# Altium schematic sheet 2015-03-26_02-24-551.schdoc
size 186 x 111 mm; SheetNumber: 1; SheetTotal: 1
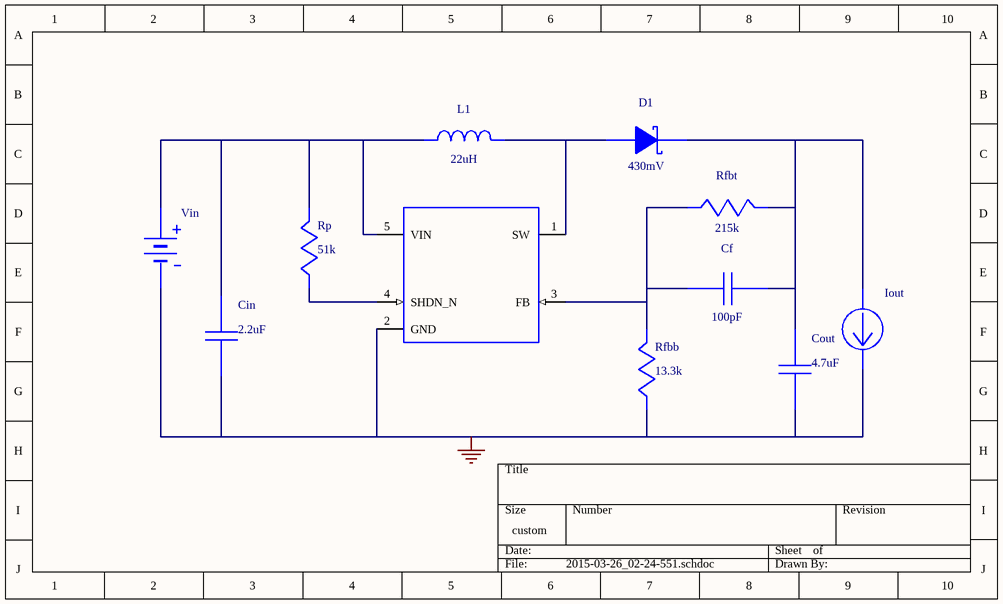
[diagram p0: 2015-03-26_02-24-551.schdoc]

## Parts
Cf  value 100pF  (hidden comment: CC0805JRNPO9BN101)
Cin  value 2.2uF  (hidden comment: C2012X5R1A225K/0.85)
Cout  value 4.7uF  (hidden comment: GRM31CR71H475KA12L)
D1  value 430mV  (hidden comment: MBR0530T1G)
Iout  WB_CURRENT_LOAD  (value not drawn)
L1  value 22uH  (hidden comment: NLCV32T-220K-PF)
Rfbb  value 13.3k  (hidden comment: CRCW040213K3FKED)
Rfbt  value 215k  (hidden comment: CRCW0402215KFKED)
Rp  value 51k  (hidden comment: RR1220P-513-D)
U1  LM27313XMF/NOPB  (value not drawn)
Vin  WB_BATTERY  (value not drawn)

## Nets
0: Cin.2 Cout.2 Iout.2(-) Rfbb.2 U1.2(GND) Vin.2(-)
NetCf_1: Cf.1 Cout.1 D1.1(K) Iout.1(+) Rfbt.1
NetCf_2: Cf.2 Rfbb.1 Rfbt.2 U1.3(FB)
NetCin_1: Cin.1 L1.1 Rp.1 U1.5(VIN) Vin.1(+)
NetD1_2: D1.2(A) L1.2 U1.1(SW)
NetRp_2: Rp.2 U1.4(SHDN_N)

## Library data of the parts
Cf = CC0805JRNPO9BN101: CC0805JRNPO9BN10; Manufacturer Name: Yageo America; PackageReference: CC0805JRNPO9BN101; Manufacturer Part Number: CC0805JRNPO9BN101
Cin = C2012X5R1A225K/0.85: C2012X5R1A225K/0; Manufacturer Name: TDK; PackageReference: C2012X5R1A225K/0.85; Manufacturer Part Number: C2012X5R1A225K/0.85
Cout = GRM31CR71H475KA12L: GRM31CR71H475KA1; Manufacturer Name: MuRata; PackageReference: GRM31CR71H475KA12L; Manufacturer Part Number: GRM31CR71H475KA12L
D1 = MBR0530T1G: Manufacturer Name: ON Semiconductor; PackageReference: MBR0530T1G; Manufacturer Part Number: MBR0530T1G
Iout = WB_CURRENT_LOAD: Value: UNLISTED; PackageReference: WB_CURRENT_LOAD; Manufacturer Part Number: WB_CURRENT_LOAD; Manufacturer Name: WB_CURRENT_LOAD
L1 = NLCV32T-220K-PF: Manufacturer Name: TDK; PackageReference: NLCV32T-220K-PF; Manufacturer Part Number: NLCV32T-220K-PF
Rfbb = CRCW040213K3FKED: Manufacturer Name: Vishay-Dale; PackageReference: CRCW040213K3FKED; Manufacturer Part Number: CRCW040213K3FKED
Rfbt = CRCW0402215KFKED: Manufacturer Name: Vishay-Dale; PackageReference: CRCW0402215KFKED; Manufacturer Part Number: CRCW0402215KFKED
Rp = RR1220P-513-D: Manufacturer Name: Susumu Co Ltd; PackageReference: RR1220P-513-D; Manufacturer Part Number: RR1220P-513-D
U1 = LM27313XMF/NOPB: Manufacturer Name: Texas Instruments; PackageReference: Type; Manufacturer Part Number: LM27313XMF/NOPB; Value: Value
Vin = WB_BATTERY: Value: UNLISTED; PackageReference: WB_BATTERY; Manufacturer Part Number: WB_BATTERY; Manufacturer Name: WB_BATTERY